# Altium schematic sheet sh.SchDoc
size A3
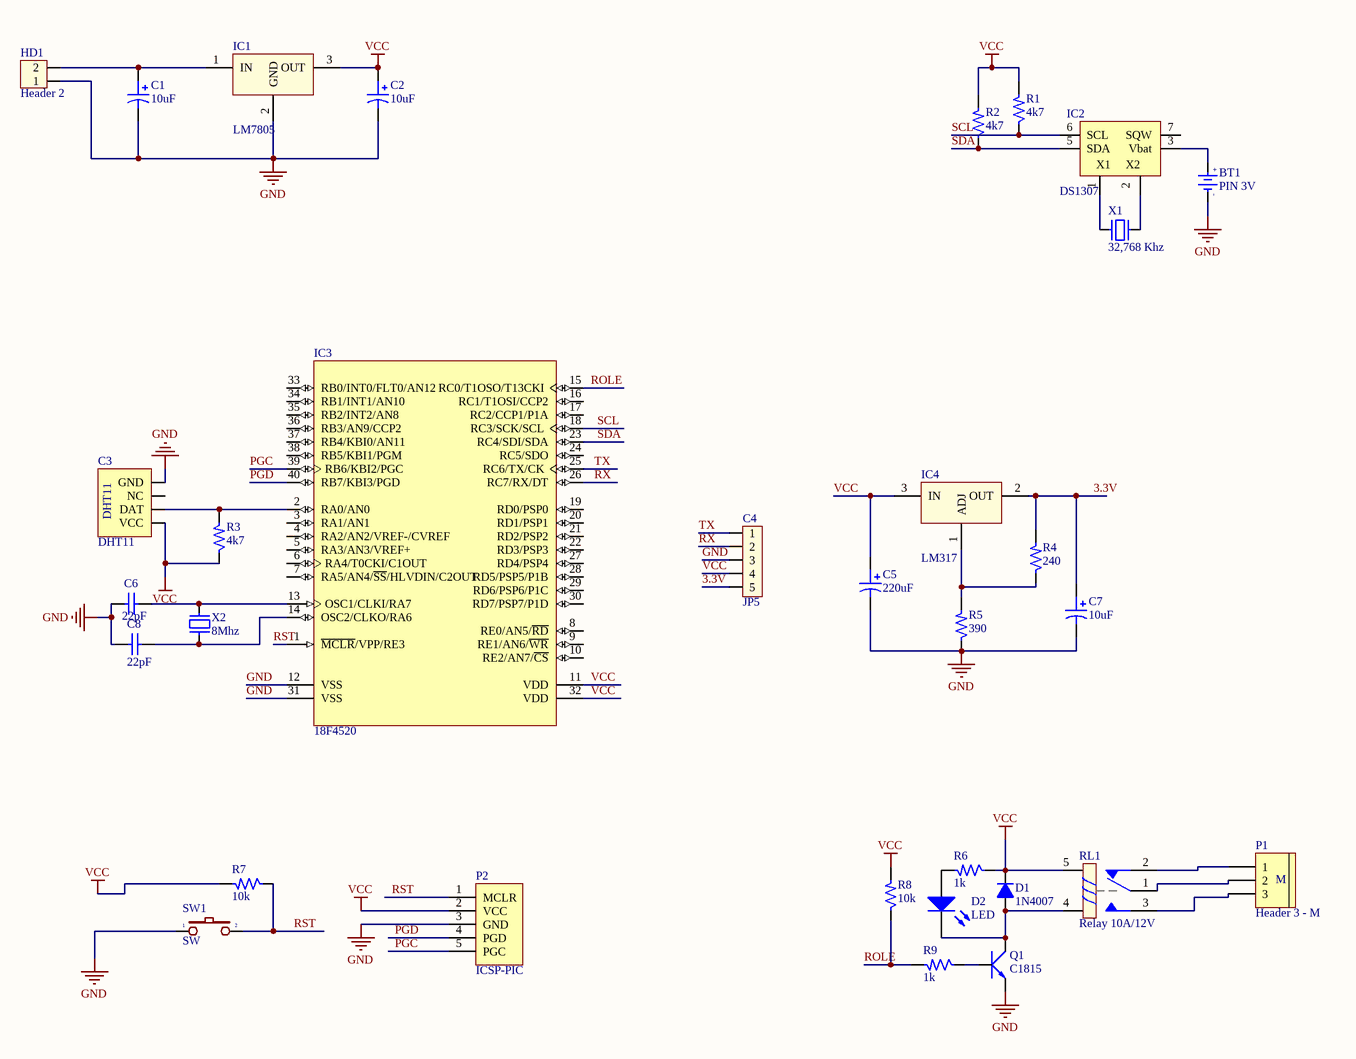
[diagram p0: sh.SchDoc]

## Parts
BT1  PIN 3V  [PIN3V]
C1  value 10uF  [RADIAL E]  (hidden comment: Cap Pol)
C2  value 10uF  [RADIAL E]  (hidden comment: Cap Pol)
C3  DHT11  [DHT11]
C4  JP5  [JP5]
C5  value 220uF  [RADIAL E]  (hidden comment: Cap Pol)
C6  value 22pF  [Cap Non-Pol 3mm]  (hidden comment: Cap Non-pol)
C7  value 10uF  [RADIAL E]  (hidden comment: Cap Pol)
C8  value 22pF  [Cap Non-Pol 3mm]  (hidden comment: Cap Non-pol)
D1  1N4007  [D1A]
D2  LED  [LED-0 5mm BLUE]
HD1  Header 2  [HED2]
IC1  LM7805  [QTO-220]
IC2  DS1307  [DIP8/W0.3]
IC3  18F4520  [DIP40/W0.6]
IC4  LM317  [QTO-220]
P1  Header 3 - M  [Medium - Header 3]
P2  ICSP-PIC  [HDR1X5]
Q1  C1815  [QTO-92]
R1  4k7  [R1/8W]
R2  4k7  [R1/8W]
R3  4k7  [R1/8W]
R4  240  [R1/8W]
R5  390  [R1/8W]
R6  1k  [R1/8W]
R7  10k  [R1/8W]
R8  10k  [R1/8W]
R9  1k  [R1/8W]
RL1  Relay 10A/12V  [RL_SPDT_10A]
SW1  SW  [SW2]
X1  32,768 Khz  [XT32k]
X2  8Mhz  [XT2]

## Nets
GND: BT1.2(GND) C1.2 C2.2 C3.4(GND) C4.3 C5.2 C6.1 C7.2 C8.1 HD1.1 IC1.2(GND) IC2.4(GND) IC3.12(VSS) IC3.31(VSS) P2.3(GND) Q1.1(E) R5.1 SW1.1
VCC: C2.1 C3.1(VCC) C4.4 C5.1 D1.2(K) IC1.3(OUT) IC2.8(VCC) IC3.11(VDD) IC3.32(VDD) IC4.3(IN) P2.2(VCC) R1.2 R2.2 R3.1 R6.1 R7.2 R8.2 RL1.5
3.3V: C4.5 C7.1 IC4.2(OUT) R4.2
PGC: IC3.39(RB6/KBI2/PGC) P2.5(PGC)
PGD: IC3.40(RB7/KBI3/PGD) P2.4(PGD)
ROLE: IC3.15(RC0/T1OSO/T13CKI) R8.1 R9.2
RST: IC3.1(~{MCLR}/VPP/RE3) P2.1(MCLR) R7.1 SW1.2
RX: C4.2 IC3.26(RC7/RX/DT)
SCL: IC2.6(SCL) IC3.18(RC3/SCK/SCL) R1.1
SDA: IC2.5(SDA) IC3.23(RC4/SDI/SDA) R2.1
TX: C4.1 IC3.25(RC6/TX/CK)
NetBT1_1: BT1.1(+3V) IC2.3(Vbat)
NetC1_1: C1.1 HD1.2 IC1.1(IN)
NetC3_2: C3.2(DAT) IC3.2(RA0/AN0) R3.2
NetC6_2: C6.2 IC3.13(OSC1/CLKI/RA7) X2.2
NetC8_2: C8.2 IC3.14(OSC2/CLKO/RA6) X2.1
NetD1_1: D1.1(A) D2.2(K) Q1.2(C) RL1.4
NetD2_1: D2.1(A) R6.2
NetIC2_1: IC2.1(X1) X1.1
NetIC2_2: IC2.2(X2) X1.2
NetIC4_1: IC4.1(ADJ) R4.1 R5.2
NetP1_1: P1.1 RL1.2
NetP1_2: P1.2 RL1.1
NetP1_3: P1.3 RL1.3
NetQ1_3: Q1.3(B) R9.1

Not connected (* = marked no-connect by the designer): C3 3(NC); IC2 7(SQW); IC3 3(RA1/AN1) 4(RA2/AN2/VREF-/CVREF) 5(RA3/AN3/VREF+) 6(RA4/T0CKI/C1OUT) 7(RA5/AN4/~{SS}/HLVDIN/C2OUT) 8(RE0/AN5/~{RD}) 9(RE1/AN6/~{WR}) 10(RE2/AN7/~{CS}) 16(RC1/T1OSI/CCP2) 17(RC2/CCP1/P1A) 19(RD0/PSP0) 20(RD1/PSP1) 21(RD2/PSP2) 22(RD3/PSP3) 24(RC5/SDO) 27(RD4/PSP4) 28(RD5/PSP5/P1B) 29(RD6/PSP6/P1C) 30(RD7/PSP7/P1D) 33(RB0/INT0/FLT0/AN12) 34(RB1/INT1/AN10) 35(RB2/INT2/AN8) 36(RB3/AN9/CCP2) 37(RB4/KBI0/AN11) 38(RB5/KBI1/PGM)

## Notes on the sheet
- (in symbol Header 3 - M) M
- (in symbol PIN 3V) +; -

## Library data of the parts
BT1 = PIN 3V: Battery 3VDC; Value: PIN 3V
C1 C2 C5 C7 = Cap Pol: Polarized Capacitor; Published: 8-Jun-2000; LatestRevisionDate: 17-Jul-2002; LatestRevisionNote: Re-released for DXP Platform.; PackageReference: POLAR0.8; Publisher: Altium Limited
C3 = DHT11: Manufacturer: W¨¹rth Elektronik eiSos GmbH; partNo: 613004143121; ComponentLink1 Description: Manufacturer; ComponentLink2 Description: Datasheet; NoPins: 04; Created Date: 29 March 2013; ComponentLink1URL: http://www.we-online.com; ComponentLink2URL: http://katalog.we-online.de/em/datasheet/6130xx143121.pdf; Created by: Karrer Zheng
C6 C8 = Cap Non-pol: Non-polarized Capacitor; Published: 8-Jun-2000; LatestRevisionDate: 17-Jul-2002; LatestRevisionNote: Re-released for DXP Platform.; PackageReference: RAD-0.3; Publisher: Altium Limited
D1 = D1A: Diode 1A; Value: 1N4007
D2 = LED: Typical LED; Published: 8-Jun-2000; LatestRevisionDate: 08-Jul-2005; LatestRevisionNote: Mech Layer 1 removed.; PackageReference: LED-1; Publisher: Altium Limited
HD1 = Hed2: Header 2 (Green); Value: Header 2
IC1 = LM78xx: On ap +, from + 5 to + 24VDC; Value: LM7805
IC2 = DS1307: Real Timer Serial; Value: DS1307
IC3 = 18F4520: 32KB Flash, 1536B RAM, 256B EFROM, 40-Pin PDIP; Value: DIP 40; Value: 18F4520; Copyright by: VanDungEvn
IC4 = LM317_1: Adj Voltage +1.2 -> +37V; Value: LM317
P1 = Header 3 - M: Header, 3-Pin, Medium; LatestRevisionDate: 17-Jul-2002; LatestRevisionNote: Re-released for DXP Platform.; Publisher: Altium Limited
P2 = ICSP-PIC: Header, 5-Pin; LatestRevisionDate: 17-Jul-2002; LatestRevisionNote: Re-released for DXP Platform.; Publisher: Altium Limited
Q1 = C1815_1: NPN 600mW, ECB; Value: C1815
R1-R9 = R: Resistor 1/4W; Value: R1/4W - 1K
RL1 = Relay 1: Relay SPDT,10A - 12VDC 5 Pin; Value: Relay SPDT, 10A, 12V
SW1 = SW2: Switch button 2 pin; Value: SW chip 2 pin
X1 = XT32k: Crystal 32,768kHz for timer real; Value: 32,768khz
X2 = XT2: Crystal For all Crystal 2pin.; Value: 4Mhz